# Altium schematic sheet VoltageRegulators.SchDoc (part 3 of 3)
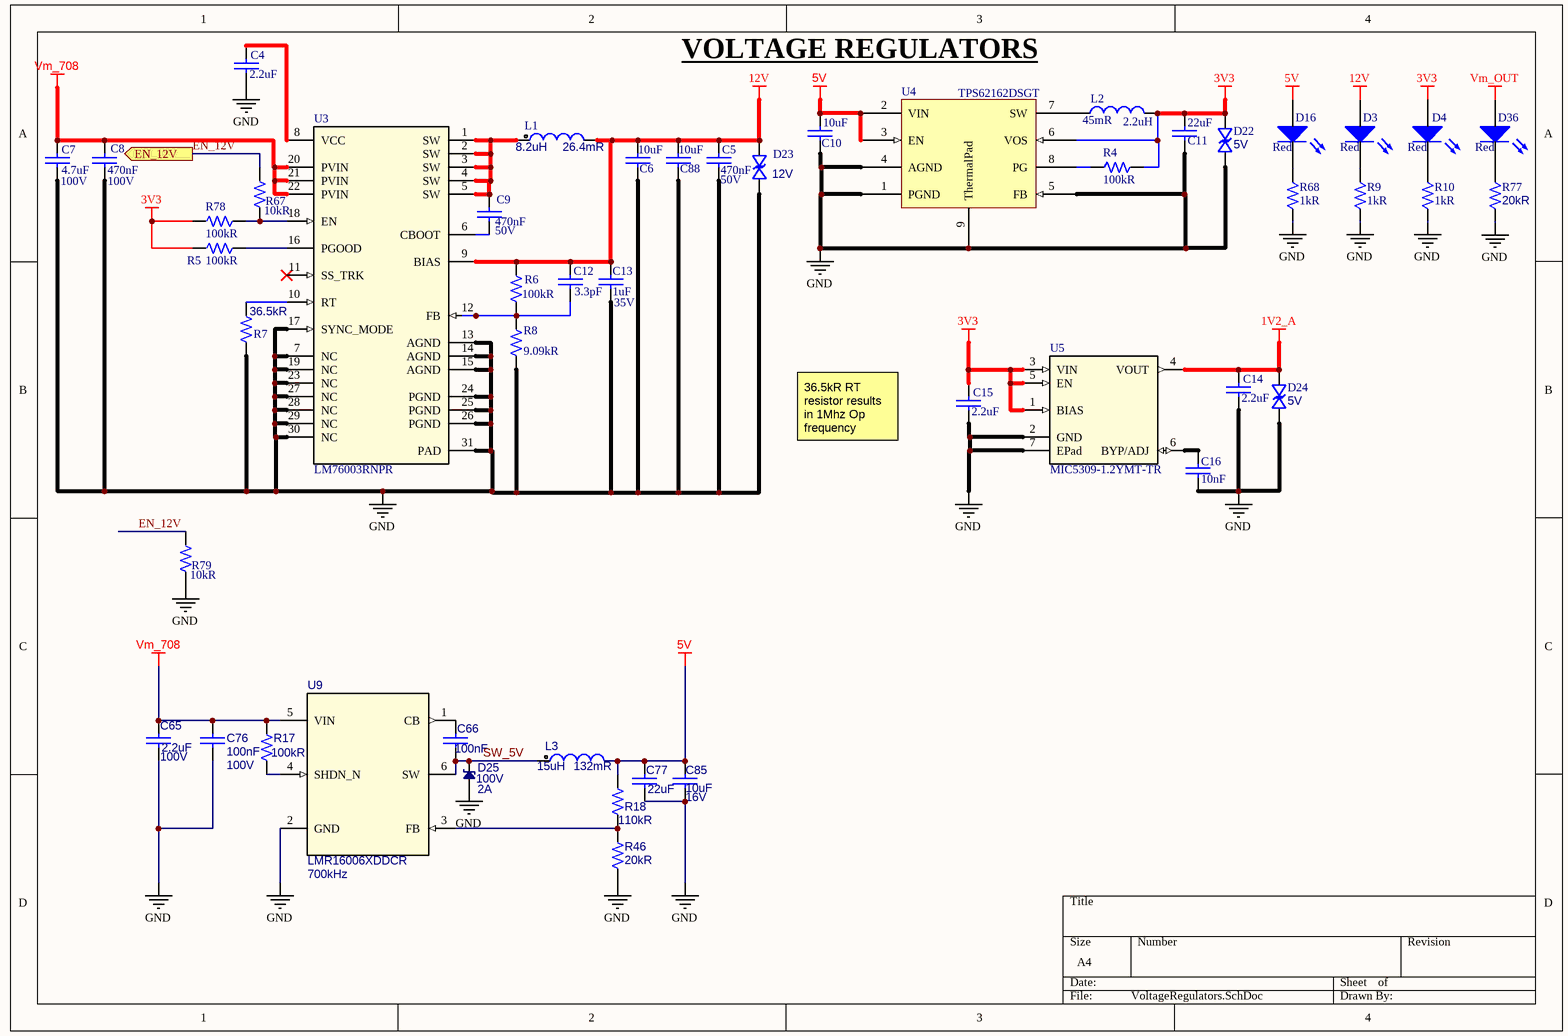
[diagram p2: VoltageRegulators.SchDoc]

## Library data of the parts (continued)
R67 R79 = Resistor: Manufacturer 1: Panasonic; Manufacturer Part Number 1: ERJ-2RKF1002X; Power Rating: 100mW; Tolerance: 1%; Voltage Rating: 50V; Temperature Coefficient: 100ppm/°C; Supplier 1: Digi-Key; Supplier Part Number 1: P10.0KLDKR-ND; Stock 1: 3290329; Pricing 1: 1=0,10000, 10=0,04100, 100=0,01680, 1000=0,00753, 2500=0,00653, 5000=0,00540 (USD); RoHS: Yes; Mount: Surface Mount; Case/Package: 0402; Number of Pins: 2; Contact Plating: Tin; Case Code (Metric): 1005; Case Code (Imperial): 0402; Min Operating Temperature: -55°C; Max Operating Temperature: 155°C; Packaging: Tape and Reel; Package Quantity: 1; Voltage Rating (DC): 50V; Features: Automotive AEC-Q200; Max Power Dissipation: 100mW; Composition: Thick Film; Number of Terminations: 2; Termination: SMD/SMT; Military Standard: Not; Length: 1mm; Height: 0.35mm; Width: 0.02inch; Depth: 0.5mm; Radiation Hardening: No; Lead Free: Lead Free; REACH SVHC: No SVHC; ComponentLink1URL: https://datasheet.ciiva.com/11821/0900766b80f80784-11821171.pdf?src-supplier=RSComponents; ComponentLink1Description: https://datasheet.ciiva.com/11821/0900766b80f80784-11821171.pdf?src-supplier=RSComponents; ComponentLink2URL: https://datasheet.ciiva.com/16199/aoa0000ce2-16199478.pdf?src-supplier=Future+Electronics; ComponentLink2Description: https://datasheet.ciiva.com/16199/aoa0000ce2-16199478.pdf?src-supplier=Future+Electronics; ComponentLink3URL: https://datasheet.ciiva.com/17212/aoa0000ce2-17212102.pdf?src-supplier=Avnet+Europe; ComponentLink3Description: https://datasheet.ciiva.com/17212/aoa0000ce2-17212102.pdf?src-supplier=Avnet+Europe; ComponentLink4URL: https://datasheet.ciiva.com/24023/aoa0000ce2-24023017.pdf?src-supplier=Mouser; ComponentLink4Description: https://datasheet.ciiva.com/24023/aoa0000ce2-24023017.pdf?src-supplier=Mouser; ComponentLink5URL: https://datasheet.ciiva.com/28514/1678782-28514185.pdf?src-supplier=Element14; ComponentLink5Description: https://datasheet.ciiva.com/28514/1678782-28514185.pdf?src-supplier=Element14; ComponentLink6URL: https://datasheet.ciiva.com/43467/1678782-43467402.pdf?src-supplier=Farnell; ComponentLink6Description: https://datasheet.ciiva.com/43467/1678782-43467402.pdf?src-supplier=Farnell; ComponentLink7URL: https://datasheet.ciiva.com/27055/1987020-27055643.pdf?src-supplier=Jameco; ComponentLink7Description: https://datasheet.ciiva.com/27055/1987020-27055643.pdf?src-supplier=Jameco; ComponentLink8URL: https://datasheet.ciiva.com/48531/aoa0000ce2-48531069.pdf?src-supplier=Avnet; ComponentLink8Description: https://datasheet.ciiva.com/48531/aoa0000ce2-48531069.pdf?src-supplier=Avnet; ComponentLink9URL: https://datasheet.ciiva.com/9194/aoa0000ce2-9194142.pdf?src-supplier=Avnet; ComponentLink9Description: https://datasheet.ciiva.com/9194/aoa0000ce2-9194142.pdf?src-supplier=Avnet; ComponentLink10URL: https://datasheet.ciiva.com/16782/70260748-16782590.pdf?src-supplier=Allied+Electronics; ComponentLink10Description: https://datasheet.ciiva.com/16782/70260748-16782590.pdf?src-supplier=Allied+Electronics; ComponentLink11URL: https://datasheet.ciiva.com/16786/70260748-16786734.pdf?src-supplier=Allied+Electronics; ComponentLink11Description: https://datasheet.ciiva.com/16786/70260748-16786734.pdf?src-supplier=Allied+Electronics; ComponentLink12URL: https://datasheet.ciiva.com/30201/aoa0000ce2-30201022.pdf?src-supplier=Onlinecomponents.com; ComponentLink12Description: https://datasheet.ciiva.com/30201/aoa0000ce2-30201022.pdf?src-supplier=Onlinecomponents.com
R77 = Resistor: RES SMD 20K OHM 5% 1/4W 0603; Manufacturer 1: Panasonic; Manufacturer Part Number 1: ERJ-PA3J203V; Max Power Dissipation: 250mW; Temperature Coefficient: 200ppm/°C; Supplier 1: Digi-Key; Supplier Part Number 1: P20KBZCT-ND; RoHS: Yes; Category: Chip SMD Resistors; Stock 1: 22079; Pricing 1: 1=0,10000, 10=0,08600, 100=0,03300, 1000=0,01452, 2500=0,01254 (USD); Case/Package: 0603; Case Code (Imperial): 0603; Case Code (Metric): 1608; Min Operating Temperature: -55°C; Max Operating Temperature: 155°C; Tolerance: 5%; Packaging: Tape and Reel; Resistor Type: Thick Film; Number of Terminations: 2; Features: Automotive AEC-Q200; Length: 0.063inch; Width: 0.031inch; Height: 0.018inch; ComponentLink1URL: https://industrial.panasonic.com/cdbs/www-data/pdf/RDO0000/AOA0000C331.pdf?src-supplier=Digi-Key; ComponentLink1Description: https://industrial.panasonic.com/cdbs/www-data/pdf/RDO0000/AOA0000C331.pdf?src-supplier=Digi-Key
U3 = LM76003RNPR: Buck Switching Regulator IC Positive Adjustable 1V 1 Output 3.5A 30-WFQFN Exposed Pad; Manufacturer 1: Texas Instruments; Number of Outputs: 1; Min Input Voltage: 3.5V; Max Input Voltage: 60V; Max Output Voltage: 57V; Switching Frequency: 2.2MHz; Synchronous Rectifier: Yes; Supplier 1: Digi-Key; Manufacturer Part Number 1: LM76003RNPR; Stock 1: 8327; Pricing 1: 1=6,06000, 10=5,44500, 25=5,14800, 100=4,23280, 250=3,79808, 500=3,66080, 1000=3,04304 (USD); RoHS: No; Mount: Surface Mount; Min Operating Temperature: -40°C; Max Operating Temperature: 125°C; Output Type: Adjustable; Packaging: Tape and Reel; Output Configuration: Positive; Min Output Voltage: 1V; Output Current: 3.5A; ComponentLink1URL: http://www.ti.com/lit/ds/symlink/lm76003.pdf?src-supplier=Digi-Key; ComponentLink1Description: http://www.ti.com/lit/ds/symlink/lm76003.pdf?src-supplier=Digi-Key; Supplier Part Number 1: 296-49740-1-ND
U4 = TPS6216X: Manufacturer 1: Texas Instruments; Min Output Voltage: 3.3V; Synchronous Rectifier: Yes; Max Output Current: 1A; Max Input Voltage: 17V; Min Input Voltage: 3V; Output Type: Fixed; Output Configuration: Positive; Quiescent Current: 17uA; Switching Frequency: 2.25MHz; Number of Outputs: 1; Supplier 1: Digi-Key; Supplier Part Number 1: 296-29897-1-ND; Stock 1: 23948; Pricing 1: 1=1,63000, 10=1,46000, 25=1,38600, 100=1,06430 (USD); RoHS: Yes; Case/Package: SOIC; Number of Pins: 8; Contact Plating: Gold; Min Operating Temperature: -40°C; Max Operating Temperature: 125°C; Max Output Voltage: 3.3V; Output Voltage: 3.3V; Output Current: 1A; Packaging: Tape and Reel; Package Quantity: 1; Nominal Output Voltage: 3.3V; Operating Supply Voltage: 17V; Length: 2.1mm; Height: 0.75mm; Width: 2.1mm; Radiation Hardening: No; REACH SVHC: No SVHC; Lead Free: Lead Free; ComponentLink1URL: https://datasheet.ciiva.com/2026/tps62160-2026052.pdf?src-supplier=Digi-Key; ComponentLink1Description: https://datasheet.ciiva.com/2026/tps62160-2026052.pdf?src-supplier=Digi-Key; ComponentLink2URL: https://datasheet.ciiva.com/2026/tps62160-2026053.pdf?src-supplier=Digi-Key; ComponentLink2Description: https://datasheet.ciiva.com/2026/tps62160-2026053.pdf?src-supplier=Digi-Key; ComponentLink3URL: https://datasheet.ciiva.com/2026/tps62160-2026054.pdf?src-supplier=Digi-Key; ComponentLink3Description: https://datasheet.ciiva.com/2026/tps62160-2026054.pdf?src-supplier=Digi-Key; ComponentLink4URL: https://datasheet.ciiva.com/46425/1857528-46425721.pdf?src-supplier=Element14; ComponentLink4Description: https://datasheet.ciiva.com/46425/1857528-46425721.pdf?src-supplier=Element14; ComponentLink5URL: https://datasheet.ciiva.com/46425/1857528-46425722.pdf?src-supplier=Element14; ComponentLink5Description: https://datasheet.ciiva.com/46425/1857528-46425722.pdf?src-supplier=Element14; ComponentLink6URL: https://datasheet.ciiva.com/46425/1857528-46425743.pdf?src-supplier=Element14; ComponentLink6Description: https://datasheet.ciiva.com/46425/1857528-46425743.pdf?src-supplier=Element14
U5 = MIC5309-xx: Linear Voltage Regulator; Manufacturer 1: Microchip; Supplier 1: Digi-Key; Supplier Part Number 1: 576-3050-1-ND; Stock 1: 5043; Pricing 1: 1=0,81000, 25=0,67000, 100=0,61000 (USD); RoHS: Yes; ComponentLink1URL: https://datasheet.ciiva.com/46425/1833743-46425628.pdf?src-supplier=Element14; ComponentLink1Description: https://datasheet.ciiva.com/46425/1833743-46425628.pdf?src-supplier=Element14
U9 = LMR16006: SIMPLE SWITCHER® 4V to 60V, 600mA Step-Down Regulator with Low Iq 6-SOT-23-THIN -40 to 125; Manufacturer 1: Texas Instruments; Number of Outputs: 1; Output Voltage: 55V; Min Output Voltage: 765mV; Synchronous Rectifier: No; Quiescent Current: 28uA; Output Type: Adjustable; Output Configuration: Positive; Supplier 1: Digi-Key; Supplier Part Number 1: 296-40293-1-ND; RoHS: Yes; Category: Power Supply Modules; Pricing 1: 1=3,26000, 10=2,93100, 25=2,77120, 100=2,40190, 250=2,27868, 500=2,04466, 1000=2,03350 (USD); Mount: Surface Mount; Case/Package: SOT-23-6; Number of Pins: 6; Contact Plating: Gold; Min Operating Temperature: -40°C; Max Operating Temperature: 125°C; Max Output Current: 600mA; Min Input Voltage: 4V; Max Input Voltage: 60V; Packaging: Tape and Reel; Max Output Voltage: 55V; Output Current: 600mA; Operating Supply Voltage: 60V; REACH SVHC: No SVHC; Lead Free: Lead Free; RoHS Compliant: Yes; ComponentLink1URL: http://www.ti.com/general/docs/lit/getliterature.tsp?genericPartNumber=LMR16006&&fileType=pdf&src-supplier=Avnet; ComponentLink1Description: http://www.ti.com/general/docs/lit/getliterature.tsp?genericPartNumber=LMR16006&&fileType=pdf&src-supplier=Avnet; ComponentLink2URL: http://www.ti.com/lit/ds/symlink/lmr16006.pdf?src-supplier=Digi-Key; ComponentLink2Description: http://www.ti.com/lit/ds/symlink/lmr16006.pdf?src-supplier=Digi-Key; ComponentLink3URL: http://www.ti.com/general/docs/lit/getliterature.tsp?genericPartNumber=LMR16006&amp;&amp;fileType=pdf&src-supplier=Farnell; ComponentLink3Description: http://www.ti.com/general/docs/lit/getliterature.tsp?genericPartNumber=LMR16006&amp;&amp;fileType=pdf&src-supplier=Farnell; ComponentLink4URL: http://www.ti.com/general/docs/lit/getliterature.tsp?genericPartNumber=LMR16006&&fileType=pdf&src-supplier=Element14; ComponentLink4Description: http://www.ti.com/general/docs/lit/getliterature.tsp?genericPartNumber=LMR16006&&fileType=pdf&src-supplier=Element14; ComponentLink5URL: http://www.ti.com/general/docs/lit/getliterature.tsp?genericPartNumber=LMR16006&amp;&amp;fileType=pdf&src-supplier=Avnet+Asia; ComponentLink5Description: http://www.ti.com/general/docs/lit/getliterature.tsp?genericPartNumber=LMR16006&amp;&amp;fileType=pdf&src-supplier=Avnet+Asia